# EAGLE design stm32_01 (EAGLE 9.5.2)

## Sheet 1 of 4: POWER
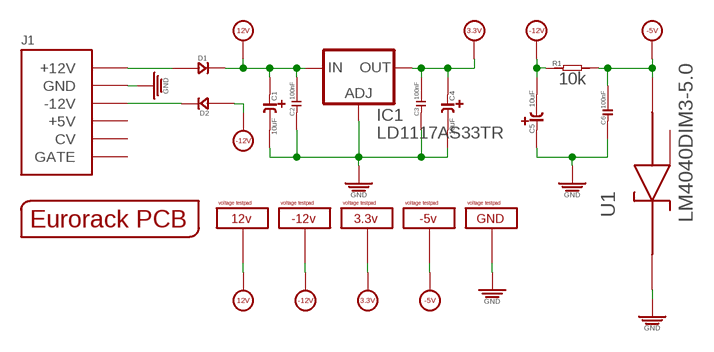
[diagram p0: schematic, sheet 1]

### Parts
C1  10uF  C-POLAR-A  [CASE-A_3216]
C2  100nF  C-0603  [C0603]
C3  100nF  C-0603  [C0603]
C4  10uF  C-POLAR-A  [CASE-A_3216]
C5  10uF  C-POLAR-A  [CASE-A_3216]
C6  100nF  C-0603  [C0603]
D1  D-SMA  [DO-214AC]
D2  D-SMA  [DO-214AC]
IC1  LD1117AS33TR  [SOT223]
J1  POWERSHROUDED  [POWER_16_SHROUDED]
PCB1  EURORACK_PCB12HP  [EURORACK12HPPCB]
R1  10k  R-0603  [R0603]
U1  LM4040DIM3-5.0  [SOT95P237X112-3N]
U$7  VOLTAGETESTPAD  [POWERTESTPAD]
U$8  VOLTAGETESTPAD  [POWERTESTPAD]
U$37  VOLTAGETESTPAD  [POWERTESTPAD]
U$38  VOLTAGETESTPAD  [POWERTESTPAD]
U$43  VOLTAGETESTPAD  [POWERTESTPAD]

### Nets
3.3V [POWER]: C3.2 C4.+ IC1.2(OUT) IC1.4(OUT) U$37.P$1(VOLTAGE) U$37.P$2(VOLTAGE) U$37.P$3(VOLTAGE) ; also sheet 2,3,4
12V [POWER]: C1.+ C2.2 D1.2(-) IC1.3(IN) U$7.P$1(VOLTAGE) U$7.P$2(VOLTAGE) U$7.P$3(VOLTAGE) ; also sheet 4
-5V [POWER]: C6.2 R1.2 U1.2(ANODE) U$38.P$1(VOLTAGE) U$38.P$2(VOLTAGE) U$38.P$3(VOLTAGE) ; also sheet 3,4
-12V [POWER]: C5.- D2.1(+) R1.1 U$8.P$1(VOLTAGE) U$8.P$2(VOLTAGE) U$8.P$3(VOLTAGE) ; also sheet 4
GND [POWER]: C1.- C2.1 C3.1 C4.- C5.+ C6.1 IC1.1(ADJ) J1.3(GND) J1.4(GND) J1.5(GND) J1.6(GND) J1.7(GND) J1.8(GND) U1.1(CATHODE) U$43.P$1(VOLTAGE) U$43.P$2(VOLTAGE) U$43.P$3(VOLTAGE) ; also sheet 2,3,4
N$1: D2.2(-) J1.1(-12V) J1.2(-12V)
N$2: D1.1(+) J1.9(+12V) J1.10(+12V)
Unconnected: J1.11(+5V) J1.12(+5V) J1.13(CV) J1.14(CV) J1.15(GATE) J1.16(GATE) U1.3(NC)

## Sheet 2 of 4: STM
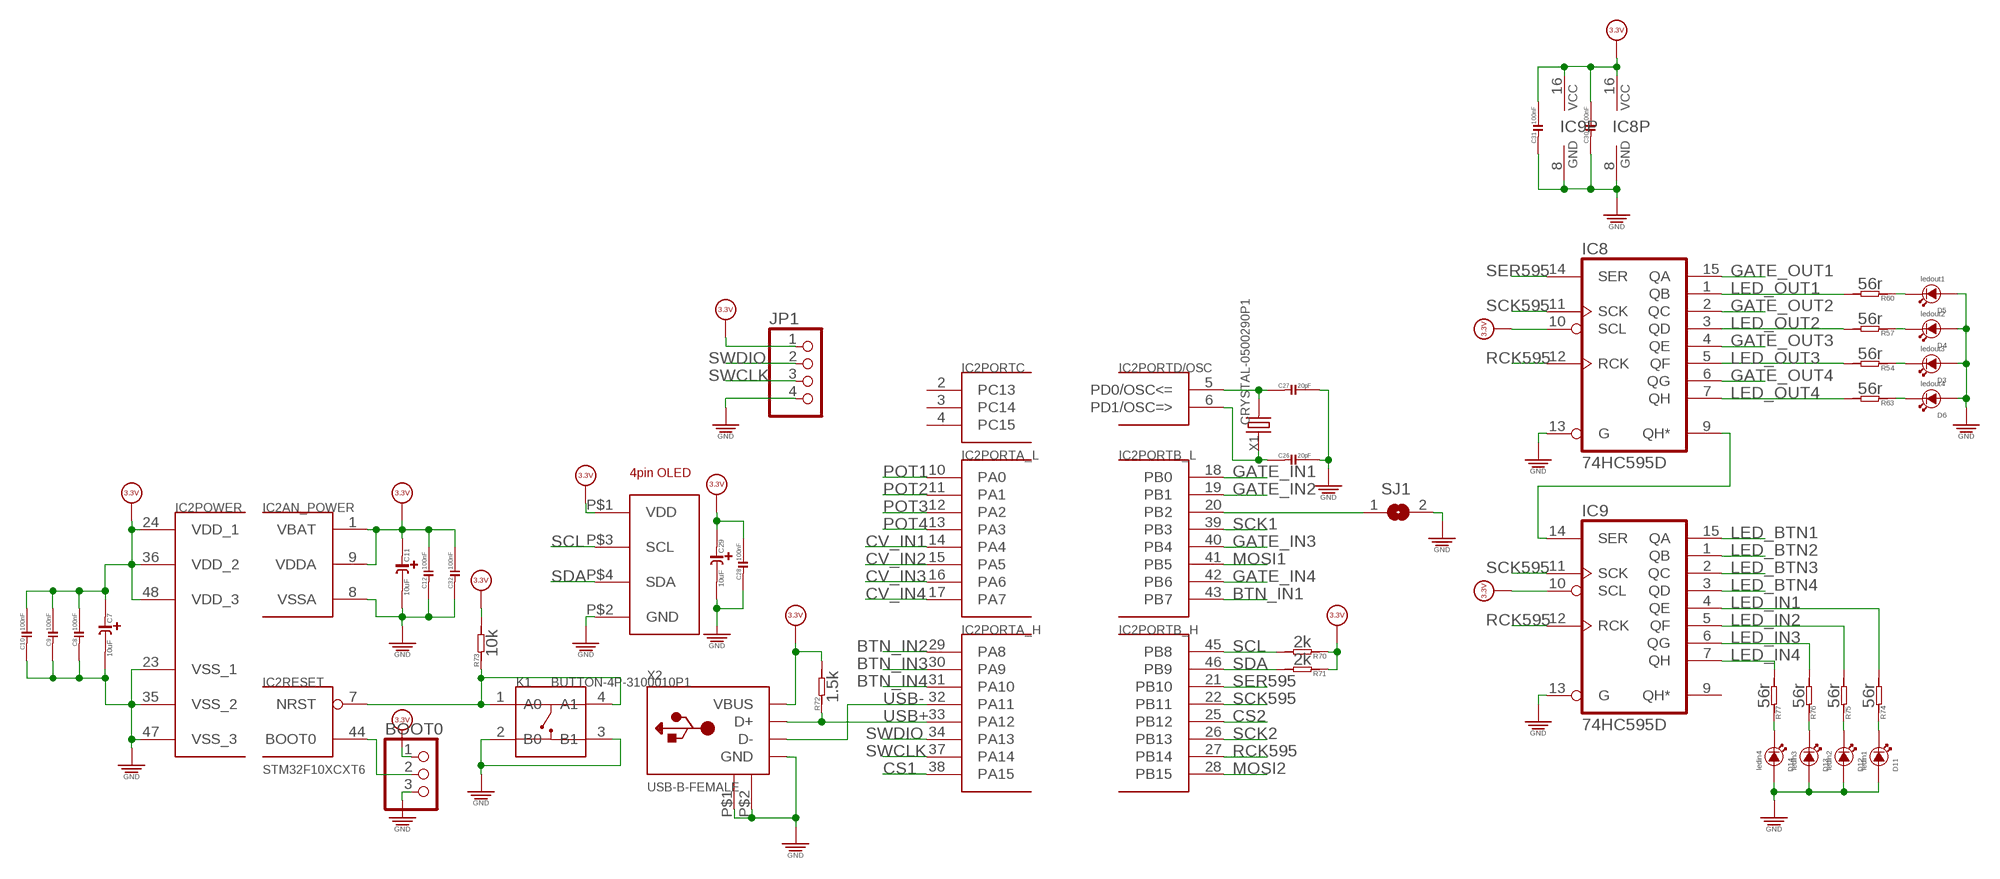
[diagram p1: schematic, sheet 2]

### Parts
BOOT0  PINHD-1X3  [1X03]
C7  10uF  C-POLAR-A  [CASE-A_3216]
C8  100nF  C-0603  [C0603]
C9  100nF  C-0603  [C0603]
C10  100nF  C-0603  [C0603]
C11  10uF  C-POLAR-A  [CASE-A_3216]
C12  100nF  C-0603  [C0603]
C26  20pF  C-0603  [C0603]
C27  20pF  C-0603  [C0603]
C28  100nF  C-0603  [C0603]
C29  10uF  C-POLAR-A  [CASE-A_3216]
C30  100nF  C-0603  [C0603]
C31  100nF  C-0603  [C0603]
C32  100nF  C-0603  [C0603]
D3  LED3MM  [3MMLED]
D4  LED3MM  [3MMLED]
D5  LED3MM  [3MMLED]
D6  LED3MM  [3MMLED]
D11  LED3MM  [3MMLED]
D12  LED3MM  [3MMLED]
D13  LED3MM  [3MMLED]
D14  LED3MM  [3MMLED]
IC2  STM32F10XCXT6  [TQFP48]
IC8  74HC595D  [SO16]
IC9  74HC595D  [SO16]
JP1  PINHD-1X4  [1X04]
K1  BUTTON-4P-3100010P1  [4P-SMD-6.0X6.0X5.0H]
R54  56r  R-0603  [R0603]
R57  56r  R-0603  [R0603]
R60  56r  R-0603  [R0603]
R63  56r  R-0603  [R0603]
R70  2k  R-0603  [R0603]
R71  2k  R-0603  [R0603]
R72  1.5k  R-0603  [R0603]
R73  10k  R-0603  [R0603]
R74  56r  R-0603  [R0603]
R75  56r  R-0603  [R0603]
R76  56r  R-0603  [R0603]
R77  56r  R-0603  [R0603]
SJ1  SJ  [SJ]
U$44  4PIN_OLED  [1.3_4PIN_OLED]
X1  CRYSTAL-0500290P1  [2P-SMD-5.0X3.2]
X2  USB-B-FEMALE  [FCI61729]

### Nets
3.3V [POWER]: BOOT0.1 C7.+ C8.2 C9.2 C10.2 C11.+ C12.2 C28.2 C29.+ C30.2 C31.2 C32.2 IC2.1(AN_POWER:VBAT) IC2.9(AN_POWER:VDDA) IC2.24(POWER:VDD_1) IC2.36(POWER:VDD_2) IC2.48(POWER:VDD_3) IC8.10(SCL) IC8.16(VCC) IC9.10(SCL) IC9.16(VCC) JP1.1 R70.1 R71.1 R72.2 R73.2 U$44.P$1(VDD) X2.1(VBUS) ; also sheet 1,3,4
BTN_IN1: IC2.43(PORTB_L:PB7) ; also sheet 3
BTN_IN2: IC2.29(PORTA_H:PA8) ; also sheet 3
BTN_IN3: IC2.30(PORTA_H:PA9) ; also sheet 3
BTN_IN4: IC2.31(PORTA_H:PA10) ; also sheet 3
CS1: IC2.38(PORTA_H:PA15) ; also sheet 4
CS2: IC2.25(PORTB_H:PB12) ; also sheet 4
CV_IN1: IC2.14(PORTA_L:PA4) ; also sheet 3
CV_IN2: IC2.15(PORTA_L:PA5) ; also sheet 3
CV_IN3: IC2.16(PORTA_L:PA6) ; also sheet 3
CV_IN4: IC2.17(PORTA_L:PA7) ; also sheet 3
GATE_IN1: IC2.18(PORTB_L:PB0) ; also sheet 3
GATE_IN2: IC2.19(PORTB_L:PB1) ; also sheet 3
GATE_IN3: IC2.40(PORTB_L:PB4) ; also sheet 3
GATE_IN4: IC2.42(PORTB_L:PB6) ; also sheet 3
GATE_OUT1: IC8.15(QA) ; also sheet 4
GATE_OUT2: IC8.2(QC) ; also sheet 4
GATE_OUT3: IC8.4(QE) ; also sheet 4
GATE_OUT4: IC8.6(QG) ; also sheet 4
GND [POWER]: BOOT0.3 C7.- C8.1 C9.1 C10.1 C11.- C12.1 C26.2 C27.2 C28.1 C29.- C30.1 C31.1 C32.1 D3.+ D4.+ D5.+ D6.+ D11.+ D12.+ D13.+ D14.+ IC2.8(AN_POWER:VSSA) IC2.23(POWER:VSS_1) IC2.35(POWER:VSS_2) IC2.47(POWER:VSS_3) IC8.8(GND) IC8.13(G) IC9.8(GND) IC9.13(G) JP1.4 K1.2(B0) K1.3(B1) SJ1.2 U$44.P$2(GND) X2.4(GND) X2.P$1(GND1) X2.P$2(GND2) ; also sheet 1,3,4
LED_BTN1: IC9.15(QA) ; also sheet 3
LED_BTN2: IC9.1(QB) ; also sheet 3
LED_BTN3: IC9.2(QC) ; also sheet 3
LED_BTN4: IC9.3(QD) ; also sheet 3
LED_IN1: IC9.4(QE) R74.2
LED_IN2: IC9.5(QF) R75.2
LED_IN3: IC9.6(QG) R76.2
LED_IN4: IC9.7(QH) R77.2
LED_OUT1: IC8.1(QB) R60.2
LED_OUT2: IC8.3(QD) R57.2
LED_OUT3: IC8.5(QF) R54.2
LED_OUT4: IC8.7(QH) R63.2
MOSI1: IC2.41(PORTB_L:PB5) ; also sheet 4
MOSI2: IC2.28(PORTB_H:PB15) ; also sheet 4
N$51: D3.- R54.1
N$59: D6.- R63.1
N$63: C27.1 IC2.5(PORTD/OSC:PD0/OSC<=) X1.2
N$64: C26.1 IC2.6(PORTD/OSC:PD1/OSC=>) X1.1
N$65: D4.- R57.1
N$67: D5.- R60.1
N$77: IC2.20(PORTB_L:PB2) SJ1.1
N$78: BOOT0.2 IC2.44(RESET:BOOT0)
N$79: IC2.7(RESET:NRST) K1.1(A0) K1.4(A1) R73.1
N$80: IC8.9(QH*) IC9.14(SER)
N$81: D11.- R74.1
N$82: D12.- R75.1
N$83: D13.- R76.1
N$84: D14.- R77.1
POT1: IC2.10(PORTA_L:PA0)
POT2: IC2.11(PORTA_L:PA1)
POT3: IC2.12(PORTA_L:PA2)
POT4: IC2.13(PORTA_L:PA3)
RCK595: IC2.27(PORTB_H:PB14) IC8.12(RCK) IC9.12(RCK)
SCK1: IC2.39(PORTB_L:PB3) ; also sheet 4
SCK2: IC2.26(PORTB_H:PB13) ; also sheet 4
SCK595: IC2.22(PORTB_H:PB11) IC8.11(SCK) IC9.11(SCK)
SCL: IC2.45(PORTB_H:PB8) R70.2 U$44.P$3(SCL)
SDA: IC2.46(PORTB_H:PB9) R71.2 U$44.P$4(SDA)
SER595: IC2.21(PORTB_H:PB10) IC8.14(SER)
SWCLK: IC2.37(PORTA_H:PA14) JP1.3
SWDIO: IC2.34(PORTA_H:PA13) JP1.2
USB+: IC2.33(PORTA_H:PA12) R72.1 X2.3(D+)
USB-: IC2.32(PORTA_H:PA11) X2.2(D-)
Unconnected: IC2.2(PORTC:PC13) IC2.3(PORTC:PC14) IC2.4(PORTC:PC15) IC9.9(QH*)

## Sheet 3 of 4: INPUTS
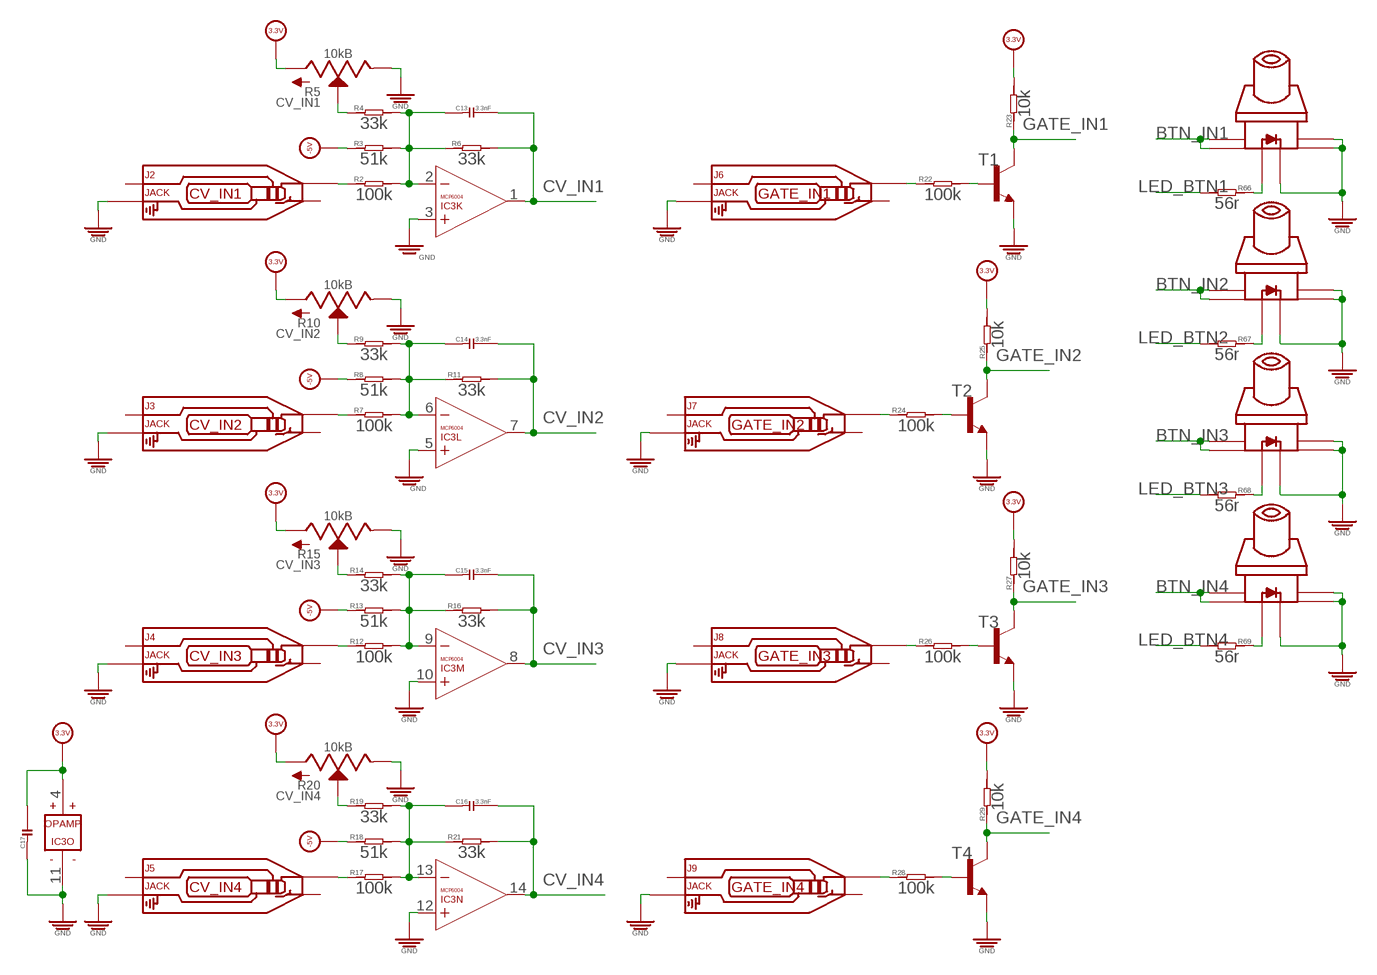
[diagram p2: schematic, sheet 3]

### Parts
C13  3.3nF  C-0603  [C0603]
C14  3.3nF  C-0603  [C0603]
C15  3.3nF  C-0603  [C0603]
C16  3.3nF  C-0603  [C0603]
C17  C-0603  [C0603]
IC3  MCP6004  [SO14]
J2  JACK  AUDIO-JACK_SMALLSYMBOLNODRILL  [3.5MM-JACK-SWITCH-13MM-NOHOLES]
J3  JACK  AUDIO-JACK_SMALLSYMBOLNODRILL  [3.5MM-JACK-SWITCH-13MM-NOHOLES]
J4  JACK  AUDIO-JACK_SMALLSYMBOLNODRILL  [3.5MM-JACK-SWITCH-13MM-NOHOLES]
J5  JACK  AUDIO-JACK_SMALLSYMBOLNODRILL  [3.5MM-JACK-SWITCH-13MM-NOHOLES]
J6  JACK  AUDIO-JACK_SMALLSYMBOLNODRILL  [3.5MM-JACK-SWITCH-13MM-NOHOLES]
J7  JACK  AUDIO-JACK_SMALLSYMBOLNODRILL  [3.5MM-JACK-SWITCH-13MM-NOHOLES]
J8  JACK  AUDIO-JACK_SMALLSYMBOLNODRILL  [3.5MM-JACK-SWITCH-13MM-NOHOLES]
J9  JACK  AUDIO-JACK_SMALLSYMBOLNODRILL  [3.5MM-JACK-SWITCH-13MM-NOHOLES]
R2  100k  R-0603  [R0603]
R3  51k  R-0603  [R0603]
R4  33k  R-0603  [R0603]
R5  10kB  POTSQUAREHOLE_SMALLKNOB  [ALPS_POT_SQUAREHOLES]
R6  33k  R-0603  [R0603]
R7  100k  R-0603  [R0603]
R8  51k  R-0603  [R0603]
R9  33k  R-0603  [R0603]
R10  10kB  POTSQUAREHOLE_SMALLKNOB  [ALPS_POT_SQUAREHOLES]
R11  33k  R-0603  [R0603]
R12  100k  R-0603  [R0603]
R13  51k  R-0603  [R0603]
R14  33k  R-0603  [R0603]
R15  10kB  POTSQUAREHOLE_SMALLKNOB  [ALPS_POT_SQUAREHOLES]
R16  33k  R-0603  [R0603]
R17  100k  R-0603  [R0603]
R18  51k  R-0603  [R0603]
R19  33k  R-0603  [R0603]
R20  10kB  POTSQUAREHOLE_SMALLKNOB  [ALPS_POT_SQUAREHOLES]
R21  33k  R-0603  [R0603]
R22  100k  R-0603  [R0603]
R23  10k  R-0603  [R0603]
R24  100k  R-0603  [R0603]
R25  10k  R-0603  [R0603]
R26  100k  R-0603  [R0603]
R27  10k  R-0603  [R0603]
R28  100k  R-0603  [R0603]
R29  10k  R-0603  [R0603]
R66  56r  R-0603  [R0603]
R67  56r  R-0603  [R0603]
R68  56r  R-0603  [R0603]
R69  56r  R-0603  [R0603]
S1  SWITCH_W_LED_PB6149L-X-102BLUE  [PB6149L]
S2  SWITCH_W_LED_PB6149L-X-102BLUE  [PB6149L]
S3  SWITCH_W_LED_PB6149L-X-102BLUE  [PB6149L]
S4  SWITCH_W_LED_PB6149L-X-102BLUE  [PB6149L]
T1  MMBT3904LT1-NPN-SOT23-BEC  [SOT23-BEC]
T2  MMBT3904LT1-NPN-SOT23-BEC  [SOT23-BEC]
T3  MMBT3904LT1-NPN-SOT23-BEC  [SOT23-BEC]
T4  MMBT3904LT1-NPN-SOT23-BEC  [SOT23-BEC]

### Nets
3.3V [POWER]: C17.2 IC3.4(O:V+) R5.P$3(A) R10.P$3(A) R15.P$3(A) R20.P$3(A) R23.2 R25.2 R27.2 R29.2 ; also sheet 1,2,4
-5V [POWER]: R3.1 R8.1 R13.1 R18.1 ; also sheet 1,4
BTN_IN1: S1.1 S1.2 ; also sheet 2
BTN_IN2: S2.1 S2.2 ; also sheet 2
BTN_IN3: S3.1 S3.2 ; also sheet 2
BTN_IN4: S4.1 S4.2 ; also sheet 2
CV_IN1: C13.2 IC3.1(K:OUT) R6.2 ; also sheet 2
CV_IN2: C14.2 IC3.7(L:OUT) R11.2 ; also sheet 2
CV_IN3: C15.2 IC3.8(M:OUT) R16.2 ; also sheet 2
CV_IN4: C16.2 IC3.14(N:OUT) R21.2 ; also sheet 2
GATE_IN1: R23.1 T1.C ; also sheet 2
GATE_IN2: R25.1 T2.C ; also sheet 2
GATE_IN3: R27.1 T3.C ; also sheet 2
GATE_IN4: R29.1 T4.C ; also sheet 2
GND [POWER]: C17.1 IC3.3(K:+IN) IC3.5(L:+IN) IC3.10(M:+IN) IC3.11(O:V-) IC3.12(N:+IN) J2.RING_B@1(RING) J2.RING_T@3(RING) J3.RING_B@1(RING) J3.RING_T@3(RING) J4.RING_B@1(RING) J4.RING_T@3(RING) J5.RING_B@1(RING) J5.RING_T@3(RING) J6.RING_B@1(RING) J6.RING_T@3(RING) J7.RING_B@1(RING) J7.RING_T@3(RING) J8.RING_B@1(RING) J8.RING_T@3(RING) J9.RING_B@1(RING) J9.RING_T@3(RING) R5.P$1(E) R10.P$1(E) R15.P$1(E) R20.P$1(E) S1.3 S1.4 S1.LEDNEG(NEG) S2.3 S2.4 S2.LEDNEG(NEG) S3.3 S3.4 S3.LEDNEG(NEG) S4.3 S4.4 S4.LEDNEG(NEG) T1.E T2.E T3.E T4.E ; also sheet 1,2,4
LED_BTN1: R66.2 ; also sheet 2
LED_BTN2: R67.2 ; also sheet 2
LED_BTN3: R68.2 ; also sheet 2
LED_BTN4: R69.2 ; also sheet 2
N$3: R4.1 R5.P$2(S)
N$4: J2.TIP_B@1(TIP) J2.TIP_T@3(TIP) R2.1
N$5: C13.1 IC3.2(K:-IN) R2.2 R3.2 R4.2 R6.1
N$6: J7.TIP_B@1(TIP) J7.TIP_T@3(TIP) R24.1
N$7: R9.1 R10.P$2(S)
N$8: J3.TIP_B@1(TIP) J3.TIP_T@3(TIP) R7.1
N$9: C14.1 IC3.6(L:-IN) R7.2 R8.2 R9.2 R11.1
N$10: R24.2 T2.B
N$11: R14.1 R15.P$2(S)
N$12: J4.TIP_B@1(TIP) J4.TIP_T@3(TIP) R12.1
N$13: C15.1 IC3.9(M:-IN) R12.2 R13.2 R14.2 R16.1
N$14: J8.TIP_B@1(TIP) J8.TIP_T@3(TIP) R26.1
N$15: R19.1 R20.P$2(S)
N$16: J5.TIP_B@1(TIP) J5.TIP_T@3(TIP) R17.1
N$17: C16.1 IC3.13(N:-IN) R17.2 R18.2 R19.2 R21.1
N$18: R26.2 T3.B
N$19: J6.TIP_B@1(TIP) J6.TIP_T@3(TIP) R22.1
N$20: R22.2 T1.B
N$21: J9.TIP_B@1(TIP) J9.TIP_T@3(TIP) R28.1
N$22: R28.2 T4.B
N$47: R69.1 S4.LEDPOS(POS)
N$48: R68.1 S3.LEDPOS(POS)
N$52: R67.1 S2.LEDPOS(POS)
N$55: R66.1 S1.LEDPOS(POS)
Unconnected: J2.SECOND_B@1(SECOND) J2.SECOND_T@3(SECOND) J2.SWITCH_B@1(SWITCH) J2.SWITCH_T@3(SWITCH) J3.SECOND_B@1(SECOND) J3.SECOND_T@3(SECOND) J3.SWITCH_B@1(SWITCH) J3.SWITCH_T@3(SWITCH) J4.SECOND_B@1(SECOND) J4.SECOND_T@3(SECOND) J4.SWITCH_B@1(SWITCH) J4.SWITCH_T@3(SWITCH) J5.SECOND_B@1(SECOND) J5.SECOND_T@3(SECOND) J5.SWITCH_B@1(SWITCH) J5.SWITCH_T@3(SWITCH) J6.SECOND_B@1(SECOND) J6.SECOND_T@3(SECOND) J6.SWITCH_B@1(SWITCH) J6.SWITCH_T@3(SWITCH) J7.SECOND_B@1(SECOND) J7.SECOND_T@3(SECOND) J7.SWITCH_B@1(SWITCH) J7.SWITCH_T@3(SWITCH) J8.SECOND_B@1(SECOND) J8.SECOND_T@3(SECOND) J8.SWITCH_B@1(SWITCH) J8.SWITCH_T@3(SWITCH) J9.SECOND_B@1(SECOND) J9.SECOND_T@3(SECOND) J9.SWITCH_B@1(SWITCH) J9.SWITCH_T@3(SWITCH)

## Sheet 4 of 4: OUTPUTS
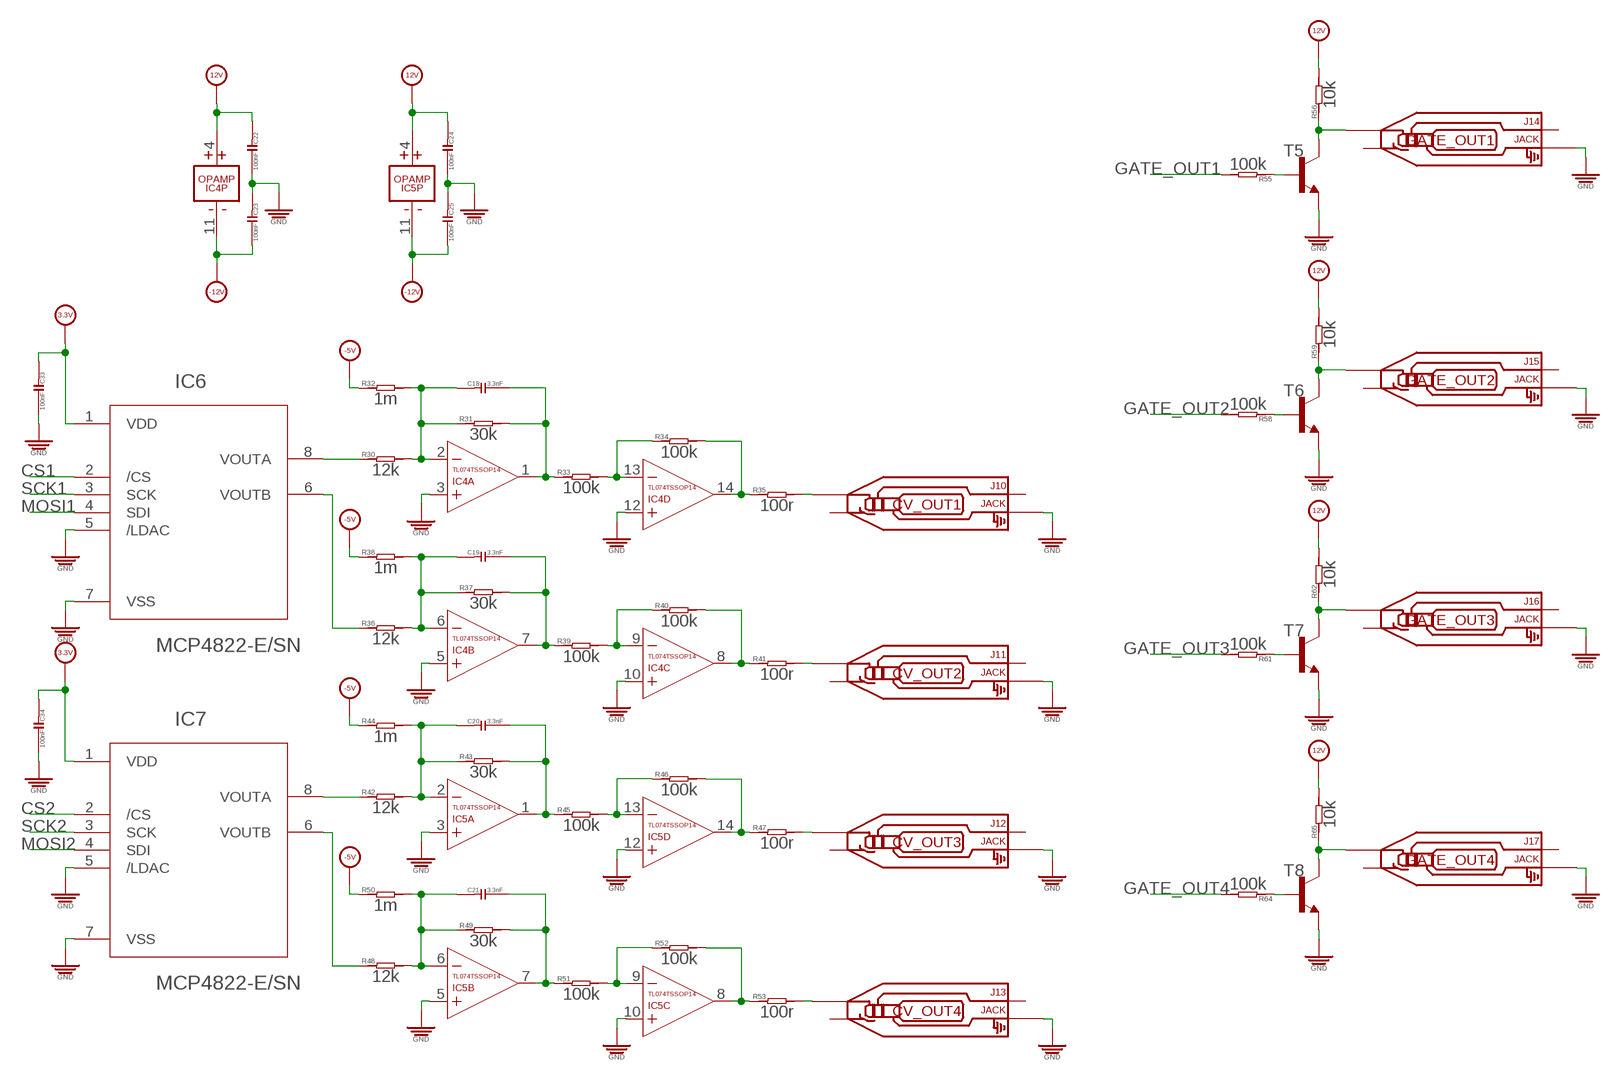
[diagram p3: schematic, sheet 4]

### Parts
C18  3.3nF  C-0603  [C0603]
C19  3.3nF  C-0603  [C0603]
C20  3.3nF  C-0603  [C0603]
C21  3.3nF  C-0603  [C0603]
C22  100nF  C-0603  [C0603]
C23  100nF  C-0603  [C0603]
C24  100nF  C-0603  [C0603]
C25  100nF  C-0603  [C0603]
C33  100nF  C-0603  [C0603]
C34  100nF  C-0603  [C0603]
IC4  TL074TSSOP14  [TSSOP14]
IC5  TL074TSSOP14  [TSSOP14]
IC6  MCP4822-E/SN  [SOIC8-N_MC]
IC7  MCP4822-E/SN  [SOIC8-N_MC]
J10  JACK  AUDIO-JACK_SMALLSYMBOLNODRILL  [3.5MM-JACK-SWITCH-13MM-NOHOLES]
J11  JACK  AUDIO-JACK_SMALLSYMBOLNODRILL  [3.5MM-JACK-SWITCH-13MM-NOHOLES]
J12  JACK  AUDIO-JACK_SMALLSYMBOLNODRILL  [3.5MM-JACK-SWITCH-13MM-NOHOLES]
J13  JACK  AUDIO-JACK_SMALLSYMBOLNODRILL  [3.5MM-JACK-SWITCH-13MM-NOHOLES]
J14  JACK  AUDIO-JACK_SMALLSYMBOLNODRILL  [3.5MM-JACK-SWITCH-13MM-NOHOLES]
J15  JACK  AUDIO-JACK_SMALLSYMBOLNODRILL  [3.5MM-JACK-SWITCH-13MM-NOHOLES]
J16  JACK  AUDIO-JACK_SMALLSYMBOLNODRILL  [3.5MM-JACK-SWITCH-13MM-NOHOLES]
J17  JACK  AUDIO-JACK_SMALLSYMBOLNODRILL  [3.5MM-JACK-SWITCH-13MM-NOHOLES]
R30  12k  R-0603  [R0603]
R31  30k  R-0603  [R0603]
R32  1m  R-0603  [R0603]
R33  100k  R-0603  [R0603]
R34  100k  R-0603  [R0603]
R35  100r  R-0603  [R0603]
R36  12k  R-0603  [R0603]
R37  30k  R-0603  [R0603]
R38  1m  R-0603  [R0603]
R39  100k  R-0603  [R0603]
R40  100k  R-0603  [R0603]
R41  100r  R-0603  [R0603]
R42  12k  R-0603  [R0603]
R43  30k  R-0603  [R0603]
R44  1m  R-0603  [R0603]
R45  100k  R-0603  [R0603]
R46  100k  R-0603  [R0603]
R47  100r  R-0603  [R0603]
R48  12k  R-0603  [R0603]
R49  30k  R-0603  [R0603]
R50  1m  R-0603  [R0603]
R51  100k  R-0603  [R0603]
R52  100k  R-0603  [R0603]
R53  100r  R-0603  [R0603]
R55  100k  R-0603  [R0603]
R56  10k  R-0603  [R0603]
R58  100k  R-0603  [R0603]
R59  10k  R-0603  [R0603]
R61  100k  R-0603  [R0603]
R62  10k  R-0603  [R0603]
R64  100k  R-0603  [R0603]
R65  10k  R-0603  [R0603]
T5  MMBT3904LT1-NPN-SOT23-BEC  [SOT23-BEC]
T6  MMBT3904LT1-NPN-SOT23-BEC  [SOT23-BEC]
T7  MMBT3904LT1-NPN-SOT23-BEC  [SOT23-BEC]
T8  MMBT3904LT1-NPN-SOT23-BEC  [SOT23-BEC]

### Nets
3.3V [POWER]: C33.1 C34.1 IC6.1(VDD) IC7.1(VDD) ; also sheet 1,2,3
12V [POWER]: C22.1 C24.1 IC4.4(P:V+) IC5.4(P:V+) R56.2 R59.2 R62.2 R65.2 ; also sheet 1
-5V [POWER]: R32.1 R38.1 R44.1 R50.1 ; also sheet 1,3
-12V [POWER]: C23.2 C25.2 IC4.11(P:V-) IC5.11(P:V-) ; also sheet 1
CS1: IC6.2(/CS) ; also sheet 2
CS2: IC7.2(/CS) ; also sheet 2
GATE_OUT1: R55.2 ; also sheet 2
GATE_OUT2: R58.2 ; also sheet 2
GATE_OUT3: R61.2 ; also sheet 2
GATE_OUT4: R64.2 ; also sheet 2
GND [POWER]: C22.2 C23.1 C24.2 C25.1 C33.2 C34.2 IC4.3(A:+IN) IC4.5(B:+IN) IC4.10(C:+IN) IC4.12(D:+IN) IC5.3(A:+IN) IC5.5(B:+IN) IC5.10(C:+IN) IC5.12(D:+IN) IC6.5(/LDAC) IC6.7(VSS) IC7.5(/LDAC) IC7.7(VSS) J10.RING_B@1(RING) J10.RING_T@3(RING) J11.RING_B@1(RING) J11.RING_T@3(RING) J12.RING_B@1(RING) J12.RING_T@3(RING) J13.RING_B@1(RING) J13.RING_T@3(RING) J14.RING_B@1(RING) J14.RING_T@3(RING) J15.RING_B@1(RING) J15.RING_T@3(RING) J16.RING_B@1(RING) J16.RING_T@3(RING) J17.RING_B@1(RING) J17.RING_T@3(RING) T5.E T6.E T7.E T8.E ; also sheet 1,2,3
MOSI1: IC6.4(SDI) ; also sheet 2
MOSI2: IC7.4(SDI) ; also sheet 2
N$23: C18.1 IC4.2(A:-IN) R30.2 R31.1 R32.2
N$24: C18.2 IC4.1(A:OUT) R31.2 R33.1
N$25: J10.TIP_B@1(TIP) J10.TIP_T@3(TIP) R35.2
N$26: IC4.13(D:-IN) R33.2 R34.1
N$27: IC4.14(D:OUT) R34.2 R35.1
N$28: IC6.8(VOUTA) R30.1
N$29: C19.1 IC4.6(B:-IN) R36.2 R37.1 R38.2
N$30: C19.2 IC4.7(B:OUT) R37.2 R39.1
N$31: IC4.9(C:-IN) R39.2 R40.1
N$32: IC4.8(C:OUT) R40.2 R41.1
N$33: IC6.6(VOUTB) R36.1
N$34: J11.TIP_B@1(TIP) J11.TIP_T@3(TIP) R41.2
N$35: C20.1 IC5.2(A:-IN) R42.2 R43.1 R44.2
N$36: C20.2 IC5.1(A:OUT) R43.2 R45.1
N$37: IC5.13(D:-IN) R45.2 R46.1
N$38: IC5.14(D:OUT) R46.2 R47.1
N$39: IC7.8(VOUTA) R42.1
N$40: J12.TIP_B@1(TIP) J12.TIP_T@3(TIP) R47.2
N$41: C21.1 IC5.6(B:-IN) R48.2 R49.1 R50.2
N$42: C21.2 IC5.7(B:OUT) R49.2 R51.1
N$43: IC5.9(C:-IN) R51.2 R52.1
N$44: IC5.8(C:OUT) R52.2 R53.1
N$45: IC7.6(VOUTB) R48.1
N$46: J13.TIP_B@1(TIP) J13.TIP_T@3(TIP) R53.2
N$49: R55.1 T5.B
N$50: J14.TIP_B@1(TIP) J14.TIP_T@3(TIP) R56.1 T5.C
N$53: R58.1 T6.B
N$54: J15.TIP_B@1(TIP) J15.TIP_T@3(TIP) R59.1 T6.C
N$57: R61.1 T7.B
N$58: J16.TIP_B@1(TIP) J16.TIP_T@3(TIP) R62.1 T7.C
N$61: R64.1 T8.B
N$62: J17.TIP_B@1(TIP) J17.TIP_T@3(TIP) R65.1 T8.C
SCK1: IC6.3(SCK) ; also sheet 2
SCK2: IC7.3(SCK) ; also sheet 2
Unconnected: J10.SECOND_B@1(SECOND) J10.SECOND_T@3(SECOND) J10.SWITCH_B@1(SWITCH) J10.SWITCH_T@3(SWITCH) J11.SECOND_B@1(SECOND) J11.SECOND_T@3(SECOND) J11.SWITCH_B@1(SWITCH) J11.SWITCH_T@3(SWITCH) J12.SECOND_B@1(SECOND) J12.SECOND_T@3(SECOND) J12.SWITCH_B@1(SWITCH) J12.SWITCH_T@3(SWITCH) J13.SECOND_B@1(SECOND) J13.SECOND_T@3(SECOND) J13.SWITCH_B@1(SWITCH) J13.SWITCH_T@3(SWITCH) J14.SECOND_B@1(SECOND) J14.SECOND_T@3(SECOND) J14.SWITCH_B@1(SWITCH) J14.SWITCH_T@3(SWITCH) J15.SECOND_B@1(SECOND) J15.SECOND_T@3(SECOND) J15.SWITCH_B@1(SWITCH) J15.SWITCH_T@3(SWITCH) J16.SECOND_B@1(SECOND) J16.SECOND_T@3(SECOND) J16.SWITCH_B@1(SWITCH) J16.SWITCH_T@3(SWITCH) J17.SECOND_B@1(SECOND) J17.SECOND_T@3(SECOND) J17.SWITCH_B@1(SWITCH) J17.SWITCH_T@3(SWITCH)

## Library data of the parts
BOOT0 = pinhead:PINHD-1X3: PIN HEADER
C1 C4 C5 C7 C11 C29 = EurorackModularParts:C-POLAR*
C2 C3 C6 C8-C10 C12-C28 C30-C34 = OPL:C*
D1 D2 = OPL:D*: DIODE
D3 = EurorackModularParts:LED*: LED; DESC: ledout3
D4 = EurorackModularParts:LED*: LED; DESC: ledout2
D5 = EurorackModularParts:LED*: LED; DESC: ledout1
D6 = EurorackModularParts:LED*: LED; DESC: ledout4
D11 = EurorackModularParts:LED*: LED; DESC: ledin1
D12 = EurorackModularParts:LED*: LED; DESC: ledin2
D13 = EurorackModularParts:LED*: LED; DESC: ledin3
D14 = EurorackModularParts:LED*: LED; DESC: ledin4
IC1 = ld-components:LD1117A?*: Low drop fixed and adjustable positive voltage regulators 1 A Source: http://www.st.com/stonline/products/literature/ds/7194/ld1117axx.pdf
IC2 = stm32:STM32F10XCXT6: ST STM32F101/103 48pin LQFP
IC3 = EurorackModularParts:MCP6004
IC4 IC5 = EurorackModularParts:TL074: OP AMP
IC6 IC7 = FarnellThings:MCP4822-E/SN: 12 Bit DAC; DESCRIPTION: 12 Bit DAC; MPN: MCP4822-E/SN; OC_FARNELL: 1439414; OC_NEWARK: 31K2975; PACKAGE: SOIC-8; SUPPLIER: Microchip
IC8 IC9 = 74xx-eu:74*595: 8-bit SHIFT REGISTER, output latch
J1 = EurorackModularParts:POWER
J2 = EurorackModularParts:AUDIO-JACK_SMALLSYMBOL: Switching Mono 3.5mm Audio Jack from Erthenvar.; DESC: CV_IN1
J3 = EurorackModularParts:AUDIO-JACK_SMALLSYMBOL: Switching Mono 3.5mm Audio Jack from Erthenvar.; DESC: CV_IN2
J4 = EurorackModularParts:AUDIO-JACK_SMALLSYMBOL: Switching Mono 3.5mm Audio Jack from Erthenvar.; DESC: CV_IN3
J5 = EurorackModularParts:AUDIO-JACK_SMALLSYMBOL: Switching Mono 3.5mm Audio Jack from Erthenvar.; DESC: CV_IN4
J6 = EurorackModularParts:AUDIO-JACK_SMALLSYMBOL: Switching Mono 3.5mm Audio Jack from Erthenvar.; DESC: GATE_IN1
J7 = EurorackModularParts:AUDIO-JACK_SMALLSYMBOL: Switching Mono 3.5mm Audio Jack from Erthenvar.; DESC: GATE_IN2
J8 = EurorackModularParts:AUDIO-JACK_SMALLSYMBOL: Switching Mono 3.5mm Audio Jack from Erthenvar.; DESC: GATE_IN3
J9 = EurorackModularParts:AUDIO-JACK_SMALLSYMBOL: Switching Mono 3.5mm Audio Jack from Erthenvar.; DESC: GATE_IN4
J10 = EurorackModularParts:AUDIO-JACK_SMALLSYMBOL: Switching Mono 3.5mm Audio Jack from Erthenvar.; DESC: CV_OUT1
J11 = EurorackModularParts:AUDIO-JACK_SMALLSYMBOL: Switching Mono 3.5mm Audio Jack from Erthenvar.; DESC: CV_OUT2
J12 = EurorackModularParts:AUDIO-JACK_SMALLSYMBOL: Switching Mono 3.5mm Audio Jack from Erthenvar.; DESC: CV_OUT3
J13 = EurorackModularParts:AUDIO-JACK_SMALLSYMBOL: Switching Mono 3.5mm Audio Jack from Erthenvar.; DESC: CV_OUT4
J14 = EurorackModularParts:AUDIO-JACK_SMALLSYMBOL: Switching Mono 3.5mm Audio Jack from Erthenvar.; DESC: GATE_OUT1
J15 = EurorackModularParts:AUDIO-JACK_SMALLSYMBOL: Switching Mono 3.5mm Audio Jack from Erthenvar.; DESC: GATE_OUT2
J16 = EurorackModularParts:AUDIO-JACK_SMALLSYMBOL: Switching Mono 3.5mm Audio Jack from Erthenvar.; DESC: GATE_OUT3
J17 = EurorackModularParts:AUDIO-JACK_SMALLSYMBOL: Switching Mono 3.5mm Audio Jack from Erthenvar.; DESC: GATE_OUT4
JP1 = pinhead:PINHD-1X4: PIN HEADER
K1 = zephod-components:BUTTON-4P
PCB1 = EurorackModularParts:EURORACK_PCB
R1-R4 R6-R9 R11-R14 R16-R19 R21-R77 = OPL:R*
R5 = EurorackModularParts:POT; DESC: CV_IN1
R10 = EurorackModularParts:POT; DESC: CV_IN2
R15 = EurorackModularParts:POT; DESC: CV_IN3
R20 = EurorackModularParts:POT; DESC: CV_IN4
S1-S4 = zephod-components:SWITCH_W_LED_PB6149L-X-102
SJ1 = jumper:SJ: SMD solder JUMPER
T1-T8 = transistor:*-NPN-: NPN Transistror BF959 corrected 2008.03.06
U1 = FarnellThings:LM4040DIM3-5.0: IC, Precision Micropower Shunt Voltage Reference, 5V,SOT-23-3; MPN: LM4040DIM3-5.0; OC_FARNELL: 9778330; OC_NEWARK: 97K3489; PACKAGE: SOT-23-3; SUPPLIER: TEXAS INSTRUMENTS
U$7 = FenixBase:VOLTAGETESTPAD; DESC: 12v
U$8 = FenixBase:VOLTAGETESTPAD; DESC: -12v
U$37 = FenixBase:VOLTAGETESTPAD; DESC: 3.3v
U$38 = FenixBase:VOLTAGETESTPAD; DESC: -5v
U$43 = FenixBase:VOLTAGETESTPAD; DESC: GND
U$44 = oled:4PIN_OLED
X1 = OPL:CRYSTAL*
X2 = ld-components:USB-B-FEMALE: USB type B receptacle FCI 61729-59796

## Net classes
0 default: width 0.203 mm
1 POWER: width 0.254 mm

## Board
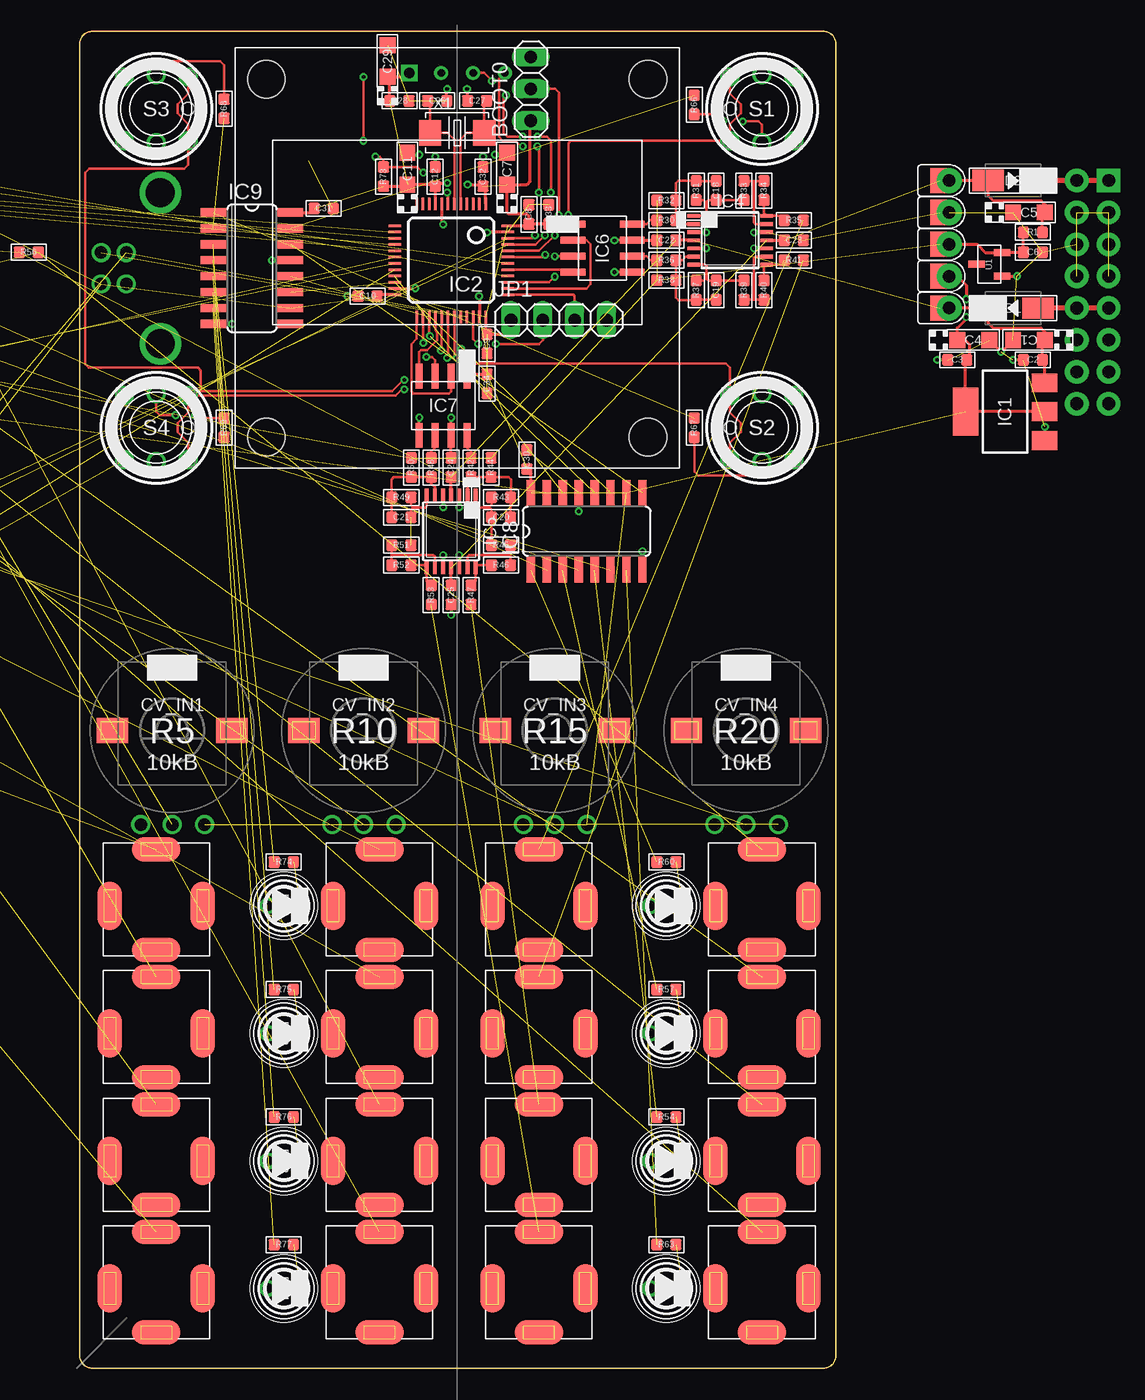
[diagram p4: board, top side]
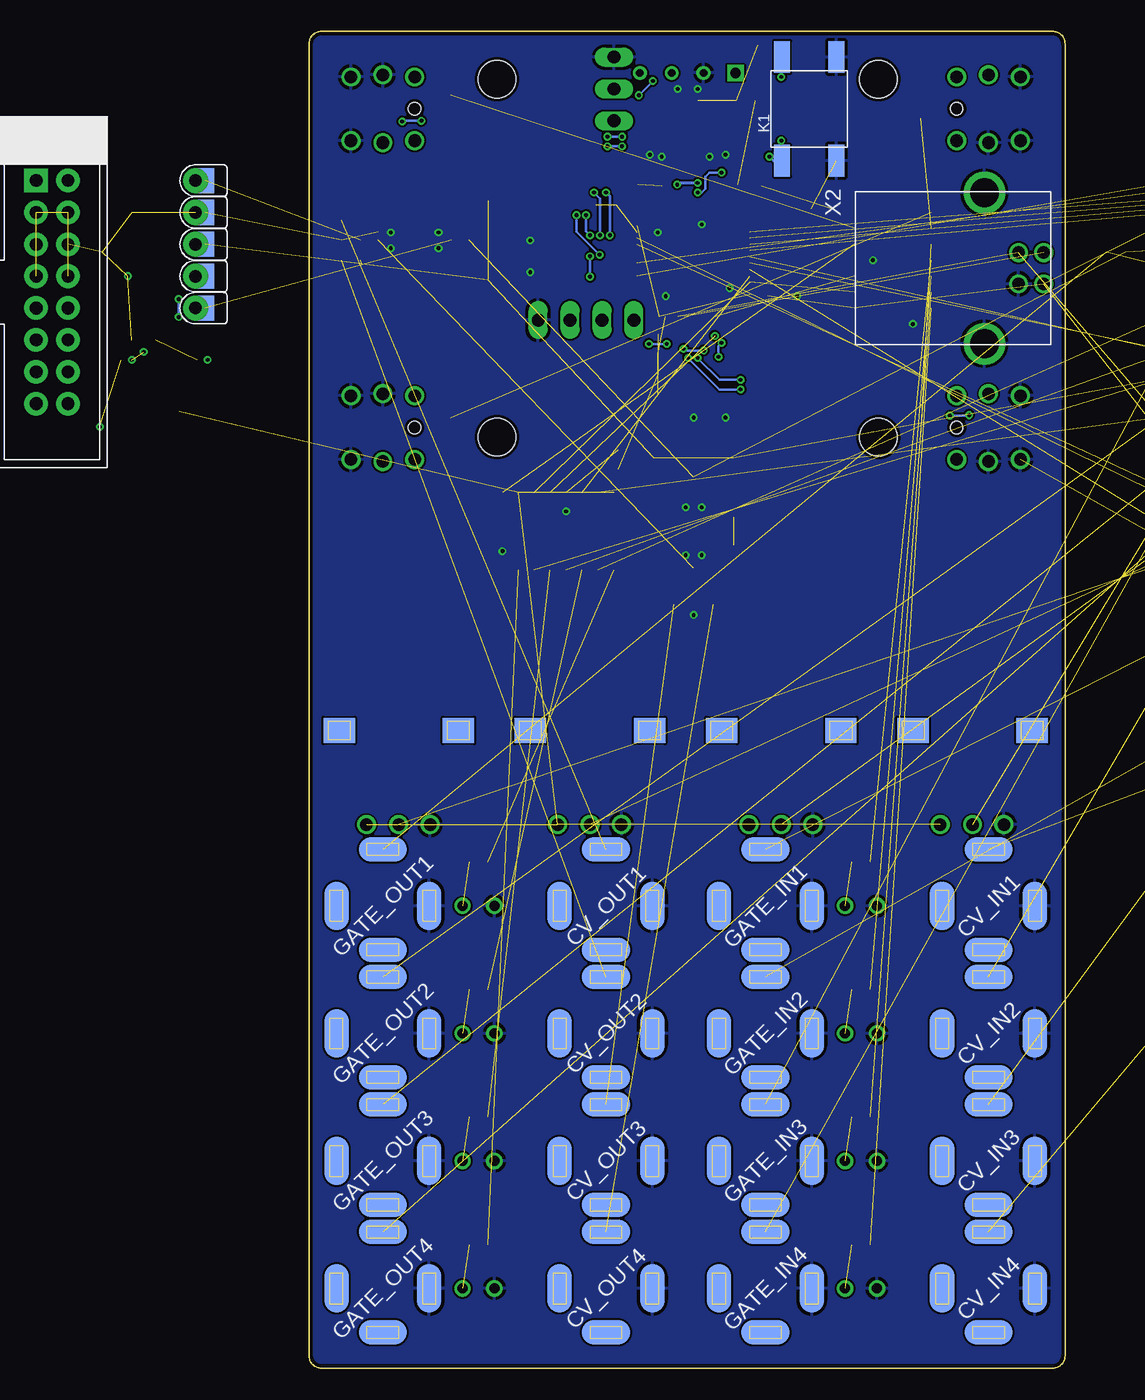
[diagram p5: board, bottom side, seen from below]

Size 60.25 x 106.5 mm. Coordinates in mm from the lower left corner, seen from the top.
Copper layers (1*16): Top 0.035mm / dielectric 1.5mm / Bottom 0.035mm
Design rules "ITeadstudio": minimum track width 6mil, minimum drill 12mil, track to track 6mil, track to pad 6mil, pad to pad 6mil, via to via 6mil, smd to smd 0mil, copper to edge 10mil, drill to drill 10mil, minimum pad ring 10mil, minimum via ring 6mil, stop-mask expansion 2mil, vias tented up to drill 100mil, thermal gap 10mil

### Footprints (pad centres in the part's own frame; a part is rotated, then mirrored left to right if it is on the bottom)
1X03 = drill 1.016 long: 1 -2.54,0; 2 0,0; 3 2.54,0
CASE-A_3216 = smd 1.27 x 1.27: + -1.27,0; - 1.27,0
C0603 = smd 0.889 x 0.889: 1 -0.762,0; 2 0.762,0
DO-214AC = smd 2.5 x 1.7: 1 -2,0; 2 2,0
3MMLED = drill 0.8: + -1.27,0; - 1.27,0
SOT223 = smd 1.5 x 2: 1 -2.3,-3.15; 2 0,-3.15; 3 2.3,-3.15 | smd 3.8 x 2: 4 0,3.15
TQFP48 = smd 0.2 x 1: 1 -2.75,-4.5; 2 -2.25,-4.5; 3 -1.75,-4.5; 4 -1.25,-4.5; 5 -0.75,-4.5; 6 -0.25,-4.5; 7 0.25,-4.5; 8 0.75,-4.5; 9 1.25,-4.5; 10 1.75,-4.5; 11 2.25,-4.5; 12 2.75,-4.5; 25 2.75,4.5; 26 2.25,4.5; 27 1.75,4.5; 28 1.25,4.5; 29 0.75,4.5; 30 0.25,4.5; 31 -0.25,4.5; 32 -0.75,4.5; 33 -1.25,4.5; 34 -1.75,4.5; 35 -2.25,4.5; 36 -2.75,4.5 | smd 1 x 0.2: 13 4.5,-2.75; 14 4.5,-2.25; 15 4.5,-1.75; 16 4.5,-1.25; 17 4.5,-0.75; 18 4.5,-0.25; 19 4.5,0.25; 20 4.5,0.75; 21 4.5,1.25; 22 4.5,1.75; 23 4.5,2.25; 24 4.5,2.75; 37 -4.5,2.75; 38 -4.5,2.25; 39 -4.5,1.75; 40 -4.5,1.25; 41 -4.5,0.75; 42 -4.5,0.25; 43 -4.5,-0.25; 44 -4.5,-0.75; 45 -4.5,-1.25; 46 -4.5,-1.75; 47 -4.5,-2.25; 48 -4.5,-2.75
SO14 = smd 0.6 x 2.2: 1 -3.81,-2.6; 2 -2.54,-2.6; 3 -1.27,-2.6; 4 0,-2.6; 5 1.27,-2.6; 6 2.54,-2.6; 7 3.81,-2.6; 8 3.81,2.6; 9 2.54,2.6; 10 1.27,2.6; 11 0,2.6; 12 -1.27,2.6; 13 -2.54,2.6; 14 -3.81,2.6
TSSOP14 = smd 0.305 x 0.991: 1 -1.95,-2.918; 2 -1.3,-2.918; 3 -0.65,-2.918; 4 0,-2.918; 5 0.65,-2.918; 6 1.3,-2.918; 7 1.95,-2.918; 8 1.95,2.918; 9 1.3,2.918; 10 0.65,2.918; 11 0,2.918; 12 -0.65,2.918; 13 -1.3,2.918; 14 -1.95,2.918
SOIC8-N_MC = smd 1.981 x 0.559: 1 -2.362,1.905; 2 -2.362,0.635; 3 -2.362,-0.635; 4 -2.362,-1.905; 5 2.362,-1.905; 6 2.362,-0.635; 7 2.362,0.635; 8 2.362,1.905
SO16 = smd 0.66 x 2.032: 1 -4.445,-3.073; 2 -3.175,-3.073; 3 -1.905,-3.073; 4 -0.635,-3.073; 5 0.635,-3.073; 6 1.905,-3.073; 7 3.175,-3.073; 8 4.445,-3.073; 9 4.445,3.073; 10 3.175,3.073; 11 1.905,3.073; 12 0.635,3.073; 13 -0.635,3.073; 14 -1.905,3.073; 15 -3.175,3.073; 16 -4.445,3.073
POWER_16_SHROUDED = drill 1.016 pad 1.88 square: 1 -8.89,-1.27 | drill 1.016 pad 1.88: 2 -8.89,1.27; 3 -6.35,-1.27; 4 -6.35,1.27; 5 -3.81,-1.27; 6 -3.81,1.27; 7 -1.27,-1.27; 8 -1.27,1.27; 9 1.27,-1.27; 10 1.27,1.27; 11 3.81,-1.27; 12 3.81,1.27; 13 6.35,-1.27; 14 6.35,1.27; 15 8.89,-1.27; 16 8.89,1.27
3.5MM-JACK-SWITCH-13MM-NOHOLES = smd 1.95 x 3.85 bottom: RING_B@1 -3.7,0; SWITCH_B@1 3.7,0 | smd 1.95 x 3.85: RING_T@3 -3.7,0; SWITCH_T@3 3.7,0 | smd 3.85 x 1.95 bottom: SECOND_B@1 0,-3.5; TIP_B@1 0,4.5 | smd 3.85 x 1.95: SECOND_T@3 0,-3.5; TIP_T@3 0,4.5
1X04 = drill 1.016 long: 1 -3.81,0; 2 -1.27,0; 3 1.27,0; 4 3.81,0
4P-SMD-6.0X6.0X5.0H = smd 2.54 x 1.27: 1 -4.129,2.159; 2 -4.129,-2.159; 3 4.129,-2.159; 4 4.129,2.159
R0603 = smd 0.889 x 0.889: 1 -0.762,0; 2 0.762,0
ALPS_POT_SQUAREHOLES = drill 1: P$1 -2.5,-7.5; P$2 0,-7.5; P$3 2.58,-7.5 | smd 2.5 x 2: P$4 -4.75,0; P$5 4.75,0 | smd 2.5 x 2 bottom: P$6 -4.75,0; P$7 4.75,0
PB6149L = drill 1: 1 2.54,2.54; 2 2.54,-2.54; 3 -2.54,2.54; 4 -2.54,-2.54; LEDNEG 0,-2.7; LEDPOS 0,2.7 | hole 1: 2.54,0
SJ = smd 1.168 x 1.6: 1 -0.762,0; 2 0.762,0
SOT23-BEC = smd 1 x 1.4: B -0.95,-1.1; C 0,1.1; E 0.95,-1.1
SOT95P237X112-3N = smd 1.321 x 0.559: 1 -1.016,0.94; 2 -1.016,-0.94; 3 1.016,0
POWERTESTPAD = drill 1 pad 2: P$1 0,0 | smd 2 x 1.5: P$2 0,-0.75 | smd 2 x 1.5 bottom: P$3 0,-0.75
1.3_4PIN_OLED = drill 0.8 square: P$1 -3.81,0 | drill 0.6: P$2 -1.27,0; P$3 1.27,0; P$4 3.81,0 | hole 3: -15.2,-0.5; 15.2,-0.5; -15.2,-29; 15.2,-29
2P-SMD-5.0X3.2 = smd 1.778 x 2.032: 1 -2.159,0; 2 2.159,0
FCI61729 = drill 1: 1 1.25,4.71; 2 -1.25,4.71; 3 -1.25,2.71; 4 1.25,2.71 | drill 2.3: P$1 -6.02,0; P$2 6.02,0

### Placement (x,y rotation side)
BOOT0  35.95,101.92 90 top
C1  75.63,81.92 180 top  (outside the outline)
C2  75.95,80.33 0 top  (outside the outline)
C3  69.92,80.33 0 top  (outside the outline)
C4  71.19,81.92 0 top  (outside the outline)
C5  75.63,92.08 0 top  (outside the outline)
C6  75.95,88.9 180 top  (outside the outline)
C7  34.04,95.57 90 top
C8  35.79,91.92 270 top
C9  32.45,81.6 90 top
C10  22.93,85.41 0 top
C11  26.1,95.57 90 top
C12  28.32,94.93 270 top
C13  -19.3,93.98 0 top  (outside the outline)
C14  -23.11,93.98 0 top  (outside the outline)
C15  -26.92,93.98 0 top  (outside the outline)
C16  -30.73,93.98 0 top  (outside the outline)
C17  -65.02,92.71 0 top  (outside the outline)
C18  50.71,93.82 270 top
C19  50.71,85.88 90 top
C20  33.56,67.79 180 top
C21  25.63,67.79 0 top
C22  46.74,89.85 180 top
C23  56.9,89.85 180 top
C24  29.59,71.75 90 top
C25  29.59,61.59 90 top
C26  28.48,100.97 0 top
C27  31.66,100.97 180 top
C28  25.47,100.97 180 top
C29  24.52,104.14 90 top
C30  35.63,72.39 270 top
C31  19.43,92.39 180 top
C32  32.13,94.93 270 top
C33  37.37,91.92 90 top
C34  32.45,78.42 270 top
D1  74.36,84.45 180 top  (outside the outline)
D2  74.36,94.61 0 top  (outside the outline)
D3  46.74,16.51 0 top
D4  46.74,26.67 0 top
D5  46.74,36.83 0 top
D6  46.74,6.35 0 top
D11  16.26,36.83 0 top
D12  16.26,26.67 0 top
D13  16.26,16.51 0 top
D14  16.26,6.35 0 top
IC1  73.73,76.2 90 top  (outside the outline)
IC2  29.59,88.27 180 top
IC3  -60.58,54.93 0 top  (outside the outline)
IC4  51.82,89.85 270 top
IC5  29.59,66.67 180 top
IC6  41.66,89.22 0 top
IC7  28.96,76.68 270 top
IC8  40.39,66.67 0 top
IC9  13.72,87.63 270 top
J1  80.71,85.72 270 bottom  (outside the outline)
J2  6.1,36.83 0 top
J3  6.1,26.67 0 top
J4  6.1,16.51 0 top
J5  6.1,6.35 0 top
J6  23.88,36.83 0 top
J7  23.88,26.67 0 top
J8  23.88,16.51 0 top
J9  23.88,6.35 0 top
J10  36.58,36.83 0 top
J11  36.58,26.67 0 top
J12  36.58,16.51 0 top
J13  36.58,6.35 0 top
J14  54.36,36.83 0 top
J15  54.36,26.67 0 top
J16  54.36,16.51 0 top
J17  54.36,6.35 0 top
JP1  38.17,83.5 0 top
K1  20.39,100.33 90 bottom
PCB1  -0.25,0 0 top
R1  75.95,90.49 180 top  (outside the outline)
R2  -85.34,76.2 0 top  (outside the outline)
R3  -89.15,76.2 0 top  (outside the outline)
R4  -15.49,82.55 0 top  (outside the outline)
R5  7.37,50.8 0 top
R6  -19.3,82.55 0 top  (outside the outline)
R7  -23.11,82.55 0 top  (outside the outline)
R8  -26.92,82.55 0 top  (outside the outline)
R9  -30.73,82.55 0 top  (outside the outline)
R10  22.61,50.8 0 top
R11  -34.54,82.55 0 top  (outside the outline)
R12  -38.35,82.55 0 top  (outside the outline)
R13  -42.16,82.55 0 top  (outside the outline)
R14  -45.97,82.55 0 top  (outside the outline)
R15  37.85,50.8 0 top
R16  -49.78,82.55 0 top  (outside the outline)
R17  -53.59,82.55 0 top  (outside the outline)
R18  -57.4,82.55 0 top  (outside the outline)
R19  -61.21,82.55 0 top  (outside the outline)
R20  53.09,50.8 0 top
R21  -65.02,82.55 0 top  (outside the outline)
R22  -76.45,92.71 0 top  (outside the outline)
R23  -80.26,92.71 0 top  (outside the outline)
R24  -84.07,92.71 0 top  (outside the outline)
R25  -87.88,92.71 0 top  (outside the outline)
R26  -15.49,96.52 0 top  (outside the outline)
R27  -19.3,96.52 0 top  (outside the outline)
R28  -23.11,96.52 0 top  (outside the outline)
R29  -26.92,96.52 0 top  (outside the outline)
R30  46.74,91.44 0 top
R31  49.12,93.82 270 top
R32  46.74,93.03 0 top
R33  52.93,93.82 90 top
R34  54.52,93.82 270 top
R35  56.9,91.44 0 top
R36  46.74,88.27 0 top
R37  49.12,85.88 90 top
R38  46.74,86.68 0 top
R39  52.93,85.88 270 top
R40  54.52,85.88 90 top
R41  56.9,88.27 0 top
R42  31.18,71.75 270 top
R43  33.56,69.37 180 top
R44  32.77,71.75 270 top
R45  33.56,65.56 0 top
R46  33.56,63.98 180 top
R47  31.18,61.59 270 top
R48  28.01,71.75 270 top
R49  25.63,69.37 0 top
R50  26.42,71.75 270 top
R51  25.63,65.56 180 top
R52  25.63,63.98 0 top
R53  28.01,61.59 270 top
R54  46.74,20 180 top
R55  -87.88,86.36 0 top  (outside the outline)
R56  -4.06,88.9 180 top  (outside the outline)
R57  46.74,30.16 180 top
R58  -23.11,90.17 0 top  (outside the outline)
R59  -26.92,90.17 0 top  (outside the outline)
R60  46.74,40.32 180 top
R61  -34.54,90.17 0 top  (outside the outline)
R62  -38.35,90.17 0 top  (outside the outline)
R63  46.74,9.84 180 top
R64  -45.97,90.17 0 top  (outside the outline)
R65  -49.78,90.17 0 top  (outside the outline)
R66  48.96,100.65 90 top
R67  48.96,74.93 90 top
R68  11.5,100.33 270 top
R69  11.5,74.93 270 top
R70  -75.18,39.37 0 top  (outside the outline)
R71  -75.18,36.83 0 top  (outside the outline)
R72  -12.95,68.58 0 top  (outside the outline)
R73  24.2,94.93 270 top
R74  16.26,40.32 180 top
R75  16.26,30.16 180 top
R76  16.26,20 180 top
R77  16.26,9.84 180 top
S1  54.36,100.33 180 top
S2  54.36,74.93 180 top
S3  6.1,100.33 0 top
S4  6.1,74.93 0 top
SJ1  -12.95,63.5 0 top  (outside the outline)
T1  -63.75,67.31 0 top  (outside the outline)
T2  -68.83,67.31 0 top  (outside the outline)
T3  -73.91,67.31 0 top  (outside the outline)
T4  -78.99,67.31 0 top  (outside the outline)
T5  -84.07,67.31 0 top  (outside the outline)
T6  -89.15,67.31 0 top  (outside the outline)
T7  -15.49,76.2 0 top  (outside the outline)
T8  -20.57,76.2 0 top  (outside the outline)
U1  72.46,87.95 180 top  (outside the outline)
U$7  69.28,84.45 270 top  (outside the outline)
U$8  69.28,94.61 270 top  (outside the outline)
U$37  69.28,87 270 top  (outside the outline)
U$38  69.28,89.53 270 top  (outside the outline)
U$43  69.28,92.08 270 top  (outside the outline)
U$44  30.07,103.19 0 top
X1  30.07,98.42 0 top
X2  6.42,87.63 270 bottom

### Tracks (layer width: path | path; a pad name or v marks a point on that pad's centre or on a via)
3.3V  (via drill 0.3)  (24 unrouted)
  Top 0.254: IC2.24 23.8,85.52 C10.2 | IC2.36 32.34,82.47 C9.2 34.17,82.36 34.36,82.55 JP1.1 | IC2.9 28.34,94.15 C12.2 | 32.03,93.98 32.03,94.06 C32.2 | C12.2 28.52,93.98 | C12.2 28.2,94.3 C11.+ 25.98,94.17 R73.2 | IC2.1 32.34,93.96 C32.2 | IC1.2 IC1.4 70.58,80.22 C3.2 70.87,80.52 70.87,81.6 70.55,81.92 C4.+ 69.92,82.87 70.63,83.58 v70.63,83.74 | U$37.P$1 69.92,87 70.63,86.28 v70.63,85.17 | IC7.1 31.01,79.18 C34.1 | C12.2 28.58,94.42 v29.29,94.42 | v30.9,94.3 32.01,94.3 C32.2 | IC8.16 35.95,71.31 C30.2 | IC9.16 18.36,92.08 C31.2 | C28.2 24.71,102.68 C29.+ 25.94,102.87 U$44.P$1 | BOOT0.1 35.88,99.31 35.88,94.55 35.63,94.3 C7.+ 34.04,92.08 34.16,91.95 35.63,91.95 35.79,91.8 C8.2 | IC2.48 35.65,91.02 C8.2 | IC6.1 37.41,91.12 C33.1 C8.2
  Bottom 0.254: v70.63,85.17 v70.63,83.74 | v29.29,94.42 30.78,94.42 v30.9,94.3
12V  (6 unrouted)
  Top 0.254: U$7.P$1 D1.2 72.36,83.28 72.78,82.87 76.58,82.87 76.9,82.55 C1.+ 76.71,81.72 C2.2 76.88,80.16 IC1.3 | IC4.4 C22.1 | IC5.4 C24.1
-5V  (8 unrouted)
  Top 0.254: R1.2 C6.2 73.49,88.9 U1.2 72.15,88.89 71.5,89.53 U$38.P$3
-12V  (2 unrouted)
  Top 0.254: U$8.P$1 D2.1 72.36,93.44 72.78,93.03 76.58,93.03 76.9,92.71 C5.- 76.71,91.89 R1.1 | IC4.11 C23.2 | C25.2 IC5.11
BTN_IN1  (via drill 0.3)
  Top 0.203: S1.2 51.82,101.54 52.68,100.68 52.68,99.98 51.82,99.12 S1.1 39.12,97.79 38.93,97.6 v38.93,91.86 | IC2.43 36.9,88.52 v37.09,88.7
  Bottom 0.203: v37.09,88.7 38.93,90.54 v38.93,91.86
BTN_IN2  (via drill 0.3)
  Top 0.203: S2.1 51.82,73.72 52.68,74.58 52.68,75.28 51.82,76.14 S2.2 51.82,79.69 51.5,80.01 31.59,80.01 v30.4,81.2 | IC2.29 28.84,81.13 v28.79,81.07
  Bottom 0.203: v28.79,81.07 30.28,81.07 v30.4,81.2
BTN_IN3  (via drill 0.3)
  Top 0.203: S3.1 8.64,101.54 7.78,100.68 7.78,99.98 8.64,99.12 S3.2 8.64,95.89 8.32,95.57 0.74,95.57 0.42,95.25 0.42,79.98 0.7,79.69 9.43,79.69 9.65,79.47 9.65,77.83 24.87,77.83 25.79,78.74 v25.86,78.74 | v29.28,80.49 29.34,80.55 IC2.30
  Bottom 0.203: v25.86,78.74 27.53,78.74 v29.28,80.49
BTN_IN4  (via drill 0.3)
  Top 0.203: S4.2 8.64,73.72 7.78,74.58 7.78,75.28 8.64,76.14 S4.1 25.15,77.47 25.66,77.98 v25.86,77.98 | v30.04,80.49 29.84,80.68 IC2.31
  Bottom 0.203: v30.04,80.49 29.84,80.28 29.84,80.25 27.56,77.98 v25.86,77.98
CS1
  Top 0.203: IC2.38 40.36,86.02 40.71,86.36 40.71,89.53 40.39,89.85 IC6.2
CS2
  Top 0.203: IC2.25 26.84,82.02 26.42,81.6 26.42,77.79 26.58,77.63 29.44,77.63 29.59,77.79 IC7.2
CV_IN1  (3 unrouted)
CV_IN2  (3 unrouted)
CV_IN3  (3 unrouted)
CV_IN4  (3 unrouted)
GATE_IN1  (2 unrouted)
GATE_IN2  (2 unrouted)
GATE_IN3  (2 unrouted)
GATE_IN4  (2 unrouted)
GATE_OUT1  (1 unrouted)
GATE_OUT2  (1 unrouted)
GATE_OUT3  (1 unrouted)
GATE_OUT4  (1 unrouted)
GND  (via drill 0.3)  (38 unrouted)
  Top 0.254: IC2.8 28.84,91.24 v28.96,91.12 | IC2.35 31.84,85.38 v31.82,85.41 | IC2.23 26.71,86.02 v26.74,86.04 | C27.2 30.9,101.89 v30.86,101.92 | C26.2 29.25,101.89 v29.28,101.92 | C12.1 v28.32,96.52 | C32.1 v32.13,96.52 | IC6.5 v42.61,87.31 | v42.61,89.85 IC6.7 C22.2 | U1.1 74.67,87.01 v74.68,87 | C2.1 v74.36,80.33 | C1.- v73.41,80.96 C4.- | C3.1 v68.33,80.33 | IC1.1 76.88,74.97 v76.9,74.99 | IC4.5 48.92,89.22 v49.91,89.22 | IC4.3 49.9,90.5 v49.91,90.49 | IC4.10 53.74,89.2 v53.73,89.22 | IC4.12 53.74,90.5 v53.73,90.49 | IC7.5 v27.05,75.72 | v29.59,75.72 IC7.7 C24.2 | C7.- 33.88,96.68 v33.09,96.68 | C11.- 26.26,96.68 v27.05,96.68 | C25.1 v29.59,60.01 | IC5.12 30.25,64.75 v30.23,64.77 | IC5.10 28.96,63.77 v28.96,64.77 | IC5.5 28.95,68.59 v28.96,68.58 | IC5.3 30.25,68.59 v30.23,68.58 | v21.34,85.41 C10.1 | IC8.13 v39.76,68.26 | IC8.8 v44.84,65.09 | IC9.8 v12.13,83.19 | IC9.13 v15.31,88.27 | IC2.47 32.48,90.52 v32.45,90.49
  pour Bottom: -0.25,106.68 60.39,106.68 60.39,0 -0.25,0
LED_BTN1  (1 unrouted)
LED_BTN2  (1 unrouted)
LED_BTN3  (1 unrouted)
LED_BTN4  (1 unrouted)
LED_IN1  (1 unrouted)
LED_IN2  (1 unrouted)
LED_IN3  (1 unrouted)
LED_IN4  (1 unrouted)
LED_OUT1  (1 unrouted)
LED_OUT2  (1 unrouted)
LED_OUT3  (1 unrouted)
LED_OUT4  (1 unrouted)
MOSI1
  Top 0.203: IC2.41 39.09,87.52 IC6.4
MOSI2
  Top 0.203: IC7.4 27.05,80.96 27.21,81.12 27.69,81.12 28.48,81.92 28.48,82.55 28.34,82.69 IC2.28
N$1
  Top 0.381: J1.1 J1.2 D2.2
N$2
  Top 0.381: J1.9 J1.10 D1.1
N$3  (1 unrouted)
N$4  (1 unrouted)
N$5  (5 unrouted)
N$6  (1 unrouted)
N$7  (1 unrouted)
N$8  (1 unrouted)
N$9  (5 unrouted)
N$10  (1 unrouted)
N$11  (1 unrouted)
N$12  (1 unrouted)
N$13  (5 unrouted)
N$14  (1 unrouted)
N$15  (1 unrouted)
N$16  (1 unrouted)
N$17  (5 unrouted)
N$18  (1 unrouted)
N$19  (1 unrouted)
N$20  (1 unrouted)
N$21  (1 unrouted)
N$22  (1 unrouted)
N$23
  Top 0.203: IC4.2 48.3,91.15 48.01,91.44 R30.2 R32.2 47.5,94.42 47.69,94.61 49.09,94.61 R31.1 C18.1
N$24
  Top 0.203: IC4.1 49.8,91.8 49.91,91.92 49.91,92.87 | R31.2 49.72,93.06 49.91,92.87 | 49.91,92.87 50.1,93.06 C18.2 R33.1
N$25  (1 unrouted)
N$26
  Top 0.203: R33.2 53.73,94.58 | 53.73,94.58 R34.1 | IC4.13 53.85,91.15 53.73,91.28 53.73,94.58
N$27
  Top 0.203: R35.1 56.14,91.76 56.09,91.8 IC4.14 54.52,92.02 R34.2
N$28
  Top 0.203: IC6.8 45.15,91.12 45.47,91.44 R30.1
N$29
  Top 0.203: IC4.6 48.3,88.55 48.01,88.27 47.53,88.27 | 47.53,88.27 R36.2 | 47.53,88.27 47.5,88.23 R38.2 47.5,85.28 47.69,85.09 49.09,85.09 R37.1 C19.1
N$30
  Top 0.203: IC4.7 49.8,87.9 49.91,87.79 49.91,86.84 | R37.2 49.72,86.65 49.91,86.84 | 49.91,86.84 50.1,86.65 C19.2 R39.1
N$31
  Top 0.203: R40.1 53.73,85.12 | 53.73,85.12 R39.2 | IC4.9 53.85,88.55 53.73,88.42 53.73,85.12
N$32  (1 unrouted)
  Top 0.203: 56.02,87.9 IC4.8 54.52,87.68 R40.2
N$33
  Top 0.203: IC6.6 45.15,88.58 45.47,88.27 R36.1
N$34  (1 unrouted)
N$35
  Top 0.203: IC5.2 30.89,70.2 31.18,70.48 R42.2 R44.2 34.17,70.99 34.36,70.8 34.36,69.41 R43.1 C20.1
N$36
  Top 0.203: IC5.1 31.55,68.69 31.66,68.58 32.61,68.58 | 32.61,68.58 32.8,68.39 C20.2 R45.1 | 32.61,68.58 32.8,68.77 R43.2
N$37
  Top 0.203: IC5.13 30.89,64.64 31.02,64.77 34.33,64.77 | R46.1 34.33,64.77 | 34.33,64.77 R45.2
N$38
  Top 0.203: R47.1 31.55,62.72 IC5.14 31.76,63.98 R46.2
N$39
  Top 0.203: IC7.8 30.86,73.34 31.18,73.03 R42.1
N$40  (1 unrouted)
N$41
  Top 0.203: IC5.6 28.3,70.2 28.01,70.48 R48.2 R50.2 25.02,70.99 24.83,70.8 24.83,69.41 | 24.83,69.41 R49.1 | C21.1 24.83,67.82 24.83,69.41
N$42  (1 unrouted)
  Top 0.203: IC5.7 27.64,68.69 27.53,68.58 26.58,68.58 | C21.2 26.39,68.39 26.58,68.58 | 26.58,68.58 26.39,68.77 R49.2
N$43
  Top 0.203: R52.1 24.86,64.77 | 24.86,64.77 R51.2 | IC5.9 28.3,64.64 28.17,64.77 24.86,64.77
N$44
  Top 0.203: R53.1 27.64,62.72 IC5.8 27.43,63.98 R52.2
N$45
  Top 0.203: IC7.6 28.32,73.34 28.01,73.03 R48.1
N$46  (1 unrouted)
N$47  (via drill 0.3)
  Top 0.203: R69.1 9.38,75.69 v9.18,75.89 | v7.64,75.93 6.37,75.93 6.1,76.2 S4.LEDPOS
  Bottom 0.203: v9.18,75.89 7.68,75.89 v7.64,75.93
N$48
  Top 0.203: R68.1 11.5,103.82 11.18,104.14 6.42,104.14 6.1,103.82 S3.LEDPOS
N$49  (1 unrouted)
N$50  (2 unrouted)
N$51  (1 unrouted)
N$52
  Top 0.203: R67.1 48.96,71.44 49.28,71.12 54.04,71.12 54.36,71.44 S2.LEDPOS
N$53  (1 unrouted)
N$54  (2 unrouted)
N$55  (via drill 0.3)
  Top 0.203: R66.1 50.77,99.89 v51.28,99.37 | v52.82,99.33 54.09,99.33 54.36,99.06 S1.LEDPOS
  Bottom 0.203: v51.28,99.37 52.78,99.37 v52.82,99.33
N$57  (1 unrouted)
N$58  (2 unrouted)
N$59  (1 unrouted)
N$61  (1 unrouted)
N$62  (2 unrouted)
N$63
  Top 0.203: IC2.5 30.34,97.91 30.86,98.42 X1.2 32.23,100.78 C27.1
N$64
  Top 0.203: IC2.6 29.84,97.86 29.28,98.42 X1.1 27.91,100.78 C26.1
N$65  (1 unrouted)
N$67  (1 unrouted)
N$77  (1 unrouted)
N$78  (via drill 0.3)
  Top 0.203: BOOT0.2 37.85,101.92 38.17,101.6 v38.17,91.86 | v37.85,90.25 36.61,89.02 IC2.44
  Bottom 0.203: v38.17,91.86 38.17,90.57 v37.85,90.25
N$79  (via drill 0.3)
  Top 0.203: IC2.7 29.34,93.59 v29.28,93.66 | v23.56,96.52 23.88,96.52 24.2,96.2 R73.1 26.93,95.69 v27.37,95.25 | v22.61,97.79 v22.61,102.87
  Bottom 0.203: v23.56,96.52 23.24,96.2 K1.1 22.55,97.73 v22.61,97.79 | v22.61,102.87 22.55,102.93 K1.4 | v29.28,93.66 28.96,93.66 28.64,93.98 28.64,94.93 28.32,95.25 v27.37,95.25
N$80  (1 unrouted)
N$81  (1 unrouted)
N$82  (1 unrouted)
N$83  (1 unrouted)
N$84  (1 unrouted)
RCK595  (via drill 0.3)  (2 unrouted)
  Top 0.203: IC2.27 27.84,82.29 v27.9,82.23
  Bottom 0.203: 27.88,82.25 v27.9,82.23
SCK1  (via drill 0.3)
  Top 0.203: IC2.39 37.41,86.52 v37.85,86.96 | v37.85,88.58 IC6.3
  Bottom 0.203: v37.85,86.96 v37.85,88.58
SCK2  (via drill 0.3)
  Top 0.203: IC2.26 27.34,81.71 v27.37,81.68 | v27.61,80.56 28.09,80.56 28.32,80.33 IC7.3
  Bottom 0.203: v27.37,81.68 27.61,81.44 v27.61,80.56
SCK595  (2 unrouted)
  Top 0.203: 42.46,69.91 IC8.11
SCL  (via drill 0.3)  (1 unrouted)
  Top 0.203: IC2.45 36.32,89.52 v37.06,90.25 | v37.53,93.66 37.53,97.79 37.22,98.11 v36.47,98.11 | v35.3,98.11 34.08,98.11 33.76,98.42 33.76,101.21 v33.96,101.41 | v32.85,102.55 32.21,103.19 U$44.P$3
  Bottom 0.203: v37.06,90.25 37.06,93.19 v37.53,93.66 | v36.47,98.11 v35.3,98.11 | v33.96,101.41 32.85,102.53 v32.85,102.55
SDA  (via drill 0.3)  (1 unrouted)
  Top 0.203: IC2.46 36.03,90.02 v36.27,90.25 | v36.58,93.66 36.58,97.23 v36.47,97.35 | v35.3,97.35 35.16,97.35 34.78,97.73 33.79,97.73 33.41,98.11 33.41,102.71 U$44.P$4
  Bottom 0.203: v36.27,90.25 36.27,93.35 v36.58,93.66 | v36.47,97.35 v35.3,97.35
SER595  (1 unrouted)
SWCLK
  Top 0.203: IC2.37 39.33,85.52 39.44,85.41 JP1.3
SWDIO  (via drill 0.3)
  Top 0.203: IC2.34 31.34,82 v31.74,81.6 | v33.16,81.6 36.58,81.6 36.9,81.92 JP1.2
  Bottom 0.203: v31.74,81.6 v33.16,81.6
USB+  (2 unrouted)
USB-  (1 unrouted)